# EasyEDA Pro project 数控电源_V3.eprj, board 输出指示灯PCB
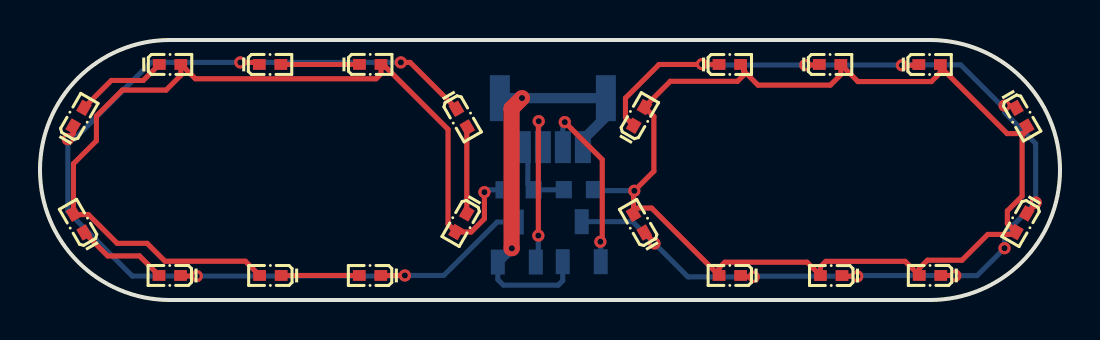
[diagram p7: board, top side]
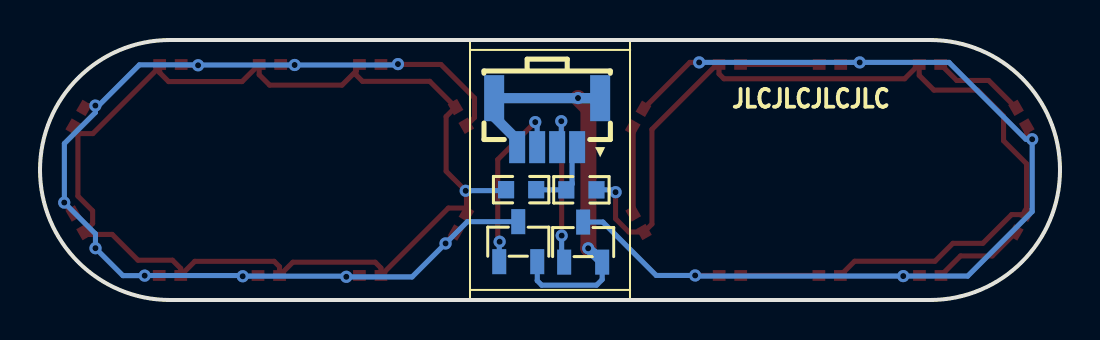
[diagram p8: board, bottom side, seen from below]

Outline 51 x 13 mm; copper layers: Top Layer, Bottom Layer. Coordinates in mm from the lower left corner of the outline.
Outline path: 6.5,0 arc(0,6.5) 6.5,13 44.5,13 arc(51,6.5) 44.5,0 6.5,0
Stack: Top Layer 0.035mm / Dielectric1 1.51mm FR4 er 4.5 / Bottom Layer 0.035mm

## Design rules (mm)
spacing copperThickness1oz (default): track to track 0.102, other pairs 0.152 to 0.3
spacing copperThickness2oz: track to track 0.203, other pairs 0.152 to 0.3
spacing Plane_innerPlane: track to track 0.102, other pairs 0.152 to 0.3
spacing Copper_copperRegion: track to track 0.102, other pairs 0.152 to 0.3
track width copperThickness1oz (default): min 0.127, default 0.254, max 2.54
track width copperThickness2oz: min 0.203, default 0.254, max 2.54
differential pair differentialPair (default): width min 0.127, default 0.254, max 2.54; gap min 0.152, default 0.152

## Placement (name value [footprint] x y rotation side)
CN1  HX 1.0-4P LTDK  [CONN-SMD_4P-P1.00_HX-1.0-4P-LTDK-1]  25.64 8.87 0 bottom
LED1  红灯  [LED0402-RD]  21.07 3.86 240 top
LED2  红灯  [LED0402-RD]  16.51 11.78 0 top
LED3  红灯  [LED0402-RD]  1.94 3.84 120 top
LED4  红灯  [LED0402-RD]  11.52 1.23 180 top
LED5  红灯  [LED0402-RD]  6.5 11.78 0 top
LED6  红灯  [LED0402-RD]  21.09 9.1 300 top
LED7  红灯  [LED0402-RD]  11.5 11.78 0 top
LED8  红灯  [LED0402-RD]  6.49 1.23 180 top
LED9  红灯  [LED0402-RD]  16.5 1.23 180 top
LED10  红灯  [LED0402-RD]  1.93 9.14 60 top
Q1  AO3400A  [SOT-23-3_L2.9-W1.3-P1.90-LS2.4-BR]  27.09 2.92 270 bottom
Q2  AO3400A  [SOT-23-3_L2.9-W1.3-P1.90-LS2.4-BR]  23.84 2.9 270 bottom
R1  100Ω  [R0603]  26.94 5.52 180 bottom
R2  120Ω  [R0603]  23.93 5.51 0 bottom
U1  蓝灯  [LED0402-RD]  34.49 11.78 0 top
U2  蓝灯  [LED0402-RD]  29.95 9.18 60 top
U3  蓝灯  [LED0402-RD]  29.94 3.84 120 top
U4  蓝灯  [LED0402-RD]  34.49 1.23 180 top
U5  蓝灯  [LED0402-RD]  39.56 1.22 180 top
U6  蓝灯  [LED0402-RD]  44.5 1.23 180 top
U7  蓝灯  [LED0402-RD]  49.06 3.86 240 top
U8  蓝灯  [LED0402-RD]  49.07 9.14 300 top
U9  蓝灯  [LED0402-RD]  44.48 11.77 0 top
U10  蓝灯  [LED0402-RD]  39.5 11.78 0 top

## Footprints (pads in the part's own frame, mm; a bottom-side part is the same pattern mirrored in y, then rotated)
CONN-SMD_4P-P1.00_HX-1.0-4P-LTDK-1
  rect 0.8x1.6 smd: 1(-1.5,1.225) 2(-0.5,1.225) 3(0.5,1.225) 4(1.5,1.225)
  rect 1x2.3 smd: 5(2.65,-1.225) 6(-2.65,-1.225)
LED0402-RD
  rect 0.636x0.54 smd: 1(-0.538,0) 2(0.538,0)
R0603
  rect 0.806x0.864 smd: 1(-0.753,0) 2(0.753,0)
SOT-23-3_L2.9-W1.3-P1.90-LS2.4-BR
  rect 1.25x0.7 smd: 1(1,-0.95) 2(1,0.95) 3(-1,0)

## Nets
As in the schematic.

## Via types
v1: diameter 0.61, hole 0.305, Top Layer to Bottom Layer, 23 vias

## Routing (per net, layer and track width the routed paths; a pad name or vN(x,y) marks a point on that pad's centre or on a via; arc(x,y) is an arc through that point)
+4.8V: length 3.9
  Bottom Layer w0.254: R1.2 26.18,5.51 R2.2 24.4,5.8 24.4,7.39 CN1.1
GND: length 23.3
  Top Layer w0.8: v1(23.59,2.59) 23.58,2.6 23.58,9.58 v1(24.1,10.1)
  Bottom Layer w0.254: Q1.2 26.14,0.97 25.91,0.74 23.17,0.74 22.89,1.02 Q2.2
  Bottom Layer w0.5: Q2.2 23.33,2.33 23.34,2.33 v1(23.59,2.59) ; v1(24.1,10.1) 23,10.1 CN1.6
  Bottom Layer w0.508: CN1.6 CN1.5 28.29,9.16 27.14,8.01 CN1.4
B: length 9.1
  Top Layer w0.254: v1(26.24,8.89) 28.11,7.02 28.11,3.01 v1(28.02,2.91)
  Bottom Layer w0.254: v1(28.02,2.91) 28.04,2.9 28.04,1.92 ; CN1.3 26.14,8.8 v1(26.24,8.89)
R: length 8.5
  Top Layer w0.254: v1(24.94,8.94) 24.92,8.92 v1(24.92,3.22)
  Bottom Layer w0.254: v1(24.92,3.22) 24.92,2.02 Q2.1 ; v1(24.94,8.94) 24.94,7.85 CN1.2
$1N545: length 60
  Top Layer w0.254: U1.1 30.95,11.78 29.27,10.1 29.27,9.12 U2.1 ; 48.23,9.72 48.69,9.72 U8.1 ; U4.1 35.1,1.16 v1(35.69,1.16) ; v1(38.27,11.75) 38.94,11.75 38.97,11.78 ; U6.1 45.76,1.23 v1(45.77,1.22) ; v1(40.86,1.19) 40.14,1.19 U5.1 ; v1(43.1,11.73) 43.9,11.73 U9.1 ; U7.1 49.78,4.77 ; U3.1 30.72,2.87 v1(30.72,2.83)
  Bottom Layer w0.254: Q1.3 29.63,3.92 v1(30.72,2.83) 32.39,1.16 35.68,1.16 v1(35.69,1.16) 35.72,1.19 40.86,1.19 v1(40.86,1.19) 40.9,1.22 45.76,1.22 v1(45.77,1.22) 46.85,1.22 v1(48.23,2.59) 48.23,3.31 v1(49.79,4.87) 49.78,4.88 49.78,7.82 48.23,9.37 v1(48.23,9.72) 48.07,9.72 46.03,11.76 43.12,11.76 v1(43.1,11.73) 43.08,11.75 v1(38.27,11.75) ; 38.27,11.75 33.15,11.75 v1(33.1,11.8)
$1N614: length 60.6
  Top Layer w0.254: 45.02,11.41 45.02,11.37 44.57,10.92 40.9,10.92 U10.2 40.04,11.27 39.52,10.74 35.9,10.74 35.2,11.44 ; 45.02,11.41 U9.2 ; 45.02,11.41 45.14,11.53 48.36,8.32 49.1,8.32 ; 29.68,4.6 29.68,5.42 29.71,5.46 30.69,6.44 30.69,9.17 U2.2 31.51,10.93 34.87,10.93 35.2,11.26 35.2,11.44 ; 29.68,4.6 U3.2 ; 29.68,4.6 30.58,4.6 33.95,1.23 33.95,1.6 34.24,1.89 38.36,1.89 U5.2 39.02,1.66 39.29,1.93 43.26,1.93 43.96,1.23 43.96,1.58 44.38,1.99 46.1,1.99 47.39,3.28 48.68,3.28 U7.2 48.37,3.82 48.37,4.46 49.1,5.19 49.1,8.32 ; 49.1,8.32 49.18,8.32 49.34,8.48 U8.2 ; U1.2 35.2,11.6 35.2,11.44 ; 35.2,11.44 35.18,11.47
  Bottom Layer w0.254: R1.1 27.74,5.47 29.71,5.47 v1(29.72,5.46)
$1N742: length 54.3
  Top Layer w0.254: v1(1.39,8.04) 1.66,8.3 LED10.1 ; v1(18.24,1.23) 17.04,1.23 ; v1(10.02,11.88) 10.86,11.88 LED7.1 ; v1(7.84,1.2) 7.06,1.2 7.03,1.23 ; LED6.1 18.51,11.88 v1(18.04,11.88)
  Bottom Layer w0.254: Q2.3 22.85,3.9 20.19,1.23 v1(18.24,1.23) 18.21,1.2 v1(7.84,1.2) 4.61,1.2 1.39,4.42 v1(1.39,8.04) 1.71,8.04 5.55,11.88 v1(10.02,11.88) ; v1(18.04,11.88) 10.02,11.88
$1N932: length 4.3
  Top Layer w0.254: LED6.2 21.34,8.61 LED1.1
$1N935: length 3.9
  Top Layer w0.254: LED2.1 15.97,11.78 LED7.2
$1N941: length 4.6
  Top Layer w0.254: 2.21,3.38 3.39,2.2 4.97,2.2 5.95,1.23
$1N948: length 46.5
  Top Layer w0.254: v1(22.22,5.39) 22.22,4.06 21.56,3.4 20.8,3.4 20.4,3.8 20.4,8.53 17.16,11.78 LED2.2 17.05,11.31 16.81,11.06 7.77,11.06 7.05,11.78 LED5.2 7.04,11.23 6.3,10.49 4.12,10.49 2.82,9.2 2.82,7.96 1.67,6.81 1.67,4.31 1.71,4.27 2.42,4.27 3.86,2.83 5.35,2.83 6.25,1.94 10.27,1.94 LED4.2
  Bottom Layer w0.254: v1(22.22,5.39) 22.34,5.51 23.18,5.51
$1N1992: length 3.9
  Top Layer w0.254: 12.06,1.23 LED9.2
$1N2073: length 4.7
  Top Layer w0.254: LED10.2 3.57,10.98 5.16,10.98 5.96,11.78

## Text on the board
Bottom Silkscreen Layer: JLCJLCJLCJLC
Document Layer: 0.8mm
